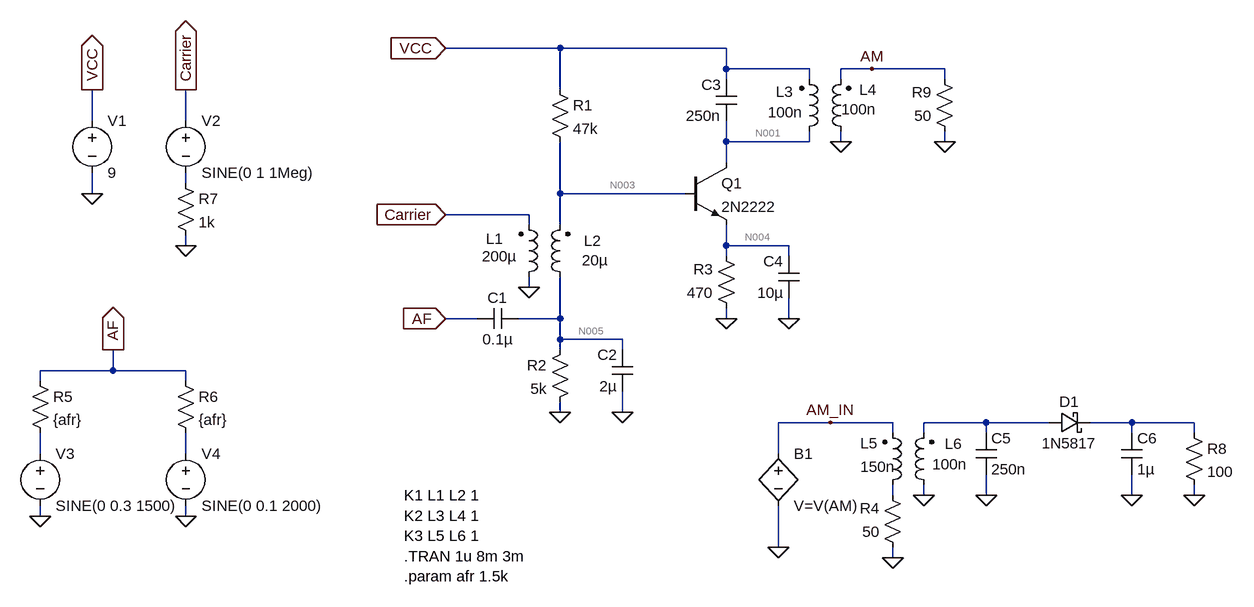
[diagram p0: schematic BaseInjectedAM.asc]
BaseInjectedAM.asc, the LTspice schematic file:
Version 4
SHEET 1 1764 800
WIRE 464 -96 288 -96
WIRE 720 -96 464 -96
WIRE 720 -64 720 -96
WIRE 848 -64 720 -64
WIRE 944 -64 896 -64
WIRE 1056 -64 944 -64
WIRE 720 -48 720 -64
WIRE 848 -48 848 -64
WIRE 896 -48 896 -64
WIRE 1056 -48 1056 -64
WIRE 464 -32 464 -96
WIRE -256 16 -256 -32
WIRE -112 16 -112 -32
WIRE 720 48 720 16
WIRE 848 48 848 32
WIRE 848 48 720 48
WIRE 896 48 896 32
WIRE 1056 48 1056 32
WIRE 720 80 720 48
WIRE -112 112 -112 96
WIRE -256 128 -256 96
WIRE 464 128 464 48
WIRE 656 128 464 128
WIRE 416 160 288 160
WIRE 416 176 416 160
WIRE 464 176 464 128
WIRE -112 208 -112 192
WIRE 720 208 720 176
WIRE 816 208 720 208
WIRE 720 224 720 208
WIRE 816 224 816 208
WIRE 416 272 416 256
WIRE 336 320 288 320
WIRE 464 320 464 256
WIRE 464 320 400 320
WIRE 720 320 720 304
WIRE 816 320 816 288
WIRE 464 352 464 320
WIRE 560 352 464 352
WIRE 464 368 464 352
WIRE 560 368 560 352
WIRE -224 400 -224 368
WIRE -224 400 -336 400
WIRE -112 400 -224 400
WIRE -336 416 -336 400
WIRE -112 416 -112 400
WIRE 464 464 464 448
WIRE 560 464 560 432
WIRE 880 480 800 480
WIRE 976 480 880 480
WIRE 1120 480 1024 480
WIRE 1216 480 1120 480
WIRE 1344 480 1280 480
WIRE 1440 480 1344 480
WIRE 976 496 976 480
WIRE 1024 496 1024 480
WIRE 1120 496 1120 480
WIRE 1344 496 1344 480
WIRE 1440 496 1440 480
WIRE -336 528 -336 496
WIRE -112 528 -112 496
WIRE 800 528 800 480
WIRE 976 592 976 576
WIRE 1024 592 1024 576
WIRE 1120 592 1120 560
WIRE 1344 592 1344 560
WIRE 1440 592 1440 576
WIRE -336 624 -336 608
WIRE -112 624 -112 608
WIRE 800 672 800 608
WIRE 976 688 976 672
FLAG -256 -32 VCC
IOPIN -256 -32 Out
FLAG -256 128 0
FLAG -112 -32 Carrier
IOPIN -112 -32 Out
FLAG 288 -96 VCC
IOPIN 288 -96 In
FLAG 896 48 0
FLAG 976 688 0
FLAG 720 320 0
FLAG 816 320 0
FLAG 464 464 0
FLAG 560 464 0
FLAG 416 272 0
FLAG 288 160 Carrier
IOPIN 288 160 In
FLAG 288 320 AF
IOPIN 288 320 In
FLAG -336 624 0
FLAG -112 624 0
FLAG -224 368 AF
IOPIN -224 368 Out
FLAG -112 208 0
FLAG 1024 592 0
FLAG 1440 592 0
FLAG 1344 592 0
FLAG 1120 592 0
FLAG 1056 48 0
FLAG 800 672 0
FLAG 944 -64 AM
FLAG 880 480 AM_IN
SYMBOL Voltage -256 0 R0
SYMATTR InstName V1
SYMATTR Value 9
SYMBOL npn 656 80 R0
SYMATTR InstName Q1
SYMATTR Value 2N2222
SYMBOL Res 448 -48 R0
SYMATTR InstName R1
SYMATTR Value 47k
SYMBOL Res 480 352 M0
SYMATTR InstName R2
SYMATTR Value 5k
SYMBOL Cap 400 304 R90
WINDOW 0 0 32 VBottom 2
WINDOW 3 32 32 VTop 2
SYMATTR InstName C1
SYMATTR Value 0.1µ
SYMBOL Cap 576 432 R180
WINDOW 0 24 56 Left 2
WINDOW 3 24 8 Left 2
SYMATTR InstName C2
SYMATTR Value 2µ
SYMBOL Cap 736 16 R180
WINDOW 0 24 56 Left 2
WINDOW 3 24 8 Left 2
SYMATTR InstName C3
SYMATTR Value 250n
SYMBOL Cap 832 288 R180
WINDOW 0 24 56 Left 2
WINDOW 3 24 8 Left 2
SYMATTR InstName C4
SYMATTR Value 10µ
SYMBOL Res 736 320 R180
WINDOW 0 36 76 Left 2
WINDOW 3 36 40 Left 2
SYMATTR InstName R3
SYMATTR Value 470
SYMBOL Res 992 688 R180
WINDOW 0 36 76 Left 2
WINDOW 3 36 40 Left 2
SYMATTR InstName R4
SYMATTR Value 50
SYMBOL ind2 400 272 M180
WINDOW 0 -50 75 Left 2
WINDOW 3 -56 48 Left 2
SYMATTR InstName L1
SYMATTR Value 200µ
SYMATTR Type ind
SYMBOL ind2 480 272 R180
WINDOW 0 -48 72 Left 2
WINDOW 3 -58 42 Left 2
SYMATTR InstName L2
SYMATTR Value 20µ
SYMATTR Type ind
SYMBOL ind2 832 48 M180
WINDOW 0 -36 77 Left 2
WINDOW 3 -48 45 Left 2
SYMATTR InstName L3
SYMATTR Value 100n
SYMATTR Type ind
SYMBOL ind2 912 48 R180
WINDOW 0 -40 80 Left 2
WINDOW 3 -39 50 Left 2
SYMATTR InstName L4
SYMATTR Value 100n
SYMATTR Type ind
SYMBOL Voltage -112 0 R0
SYMATTR InstName V2
SYMATTR Value SINE(0 1 1Meg)
SYMBOL Voltage -336 512 R0
SYMATTR InstName V3
SYMATTR Value SINE(0 0.3 1500)
SYMBOL Res -352 400 R0
SYMATTR InstName R5
SYMATTR Value {afr}
SYMBOL Res -128 400 R0
SYMATTR InstName R6
SYMATTR Value {afr}
SYMBOL Voltage -112 512 R0
SYMATTR InstName V4
SYMATTR Value SINE(0 0.1 2000)
SYMBOL Res -128 96 R0
SYMATTR InstName R7
SYMATTR Value 1k
SYMBOL ind2 960 592 M180
WINDOW 0 -34 80 Left 2
WINDOW 3 -34 44 Left 2
SYMATTR InstName L5
SYMATTR Value 150n
SYMATTR Type ind
SYMBOL ind2 1040 592 R180
WINDOW 0 -43 79 Left 2
WINDOW 3 -51 48 Left 2
SYMATTR InstName L6
SYMATTR Value 100n
SYMATTR Type ind
SYMBOL Cap 1104 496 R0
SYMATTR InstName C5
SYMATTR Value 250n
SYMBOL schottky 1216 464 M90
WINDOW 0 0 32 VBottom 2
WINDOW 3 32 32 VTop 2
SYMATTR InstName D1
SYMATTR Value 1N5817
SYMATTR Description Diode
SYMATTR Type diode
SYMBOL Res 1424 480 R0
SYMATTR InstName R8
SYMATTR Value 100
SYMBOL Cap 1328 496 R0
SYMATTR InstName C6
SYMATTR Value 1µ
SYMBOL Res 1072 48 R180
WINDOW 0 36 76 Left 2
WINDOW 3 36 40 Left 2
SYMATTR InstName R9
SYMATTR Value 50
SYMBOL bv 800 512 R0
SYMATTR InstName B1
SYMATTR Value V=V(AM)
TEXT 224 592 Left 2 !K1 L1 L2 1\nK2 L3 L4 1\nK3 L5 L6 1\n.TRAN 1u 8m 3m\n.param afr 1.5k

The netlist it stands for:
* BaseInjectedAM.asc
V1 VCC 0 9
Q1 N001 N003 N004 0 2N2222
R1 VCC N003 47k
R2 N005 0 5k
C1 N005 AF 0.1µ
C2 0 N005 2µ
C3 N001 VCC 250n
C4 0 N004 10µ
R3 0 N004 470
R4 0 N010 50
L1 0 Carrier 200µ
L2 N005 N003 20µ
L3 N001 VCC 100n
L4 0 AM 100n
V2 Carrier N002 SINE(0 1 1Meg)
V3 N008 0 SINE(0 0.3 1500)
R5 AF N008 {afr}
R6 AF N009 {afr}
V4 N009 0 SINE(0 0.1 2000)
R7 N002 0 1k
L5 N010 AM_IN 150n
L6 0 N006 100n
C5 N006 0 250n
D1 N006 N007 1N5817
R8 N007 0 100
C6 N007 0 1µ
R9 0 AM 50
B1 AM_IN 0 V=V(AM)
.model D D
.lib standard.dio
.model NPN NPN
.model PNP PNP
.lib standard.bjt
K1 L1 L2 1
K2 L3 L4 1
K3 L5 L6 1
.TRAN 1u 8m 3m
.param afr 1.5k
.backanno
.end

* Results of the author's LTspice run, read from the files saved beside the schematic
* Operating Point, zero values left out:
*   V(vcc) = 9 V
*   V(n001) = 9 V
*   V(n003) = 855.6 mV
*   V(n004) = 221.8 mV
*   V(n005) = 855.6 mV
*   Ic(Q1) = 469.8 µA
*   Ib(Q1) = 2.175 µA
*   Ie(Q1) = -472 µA
*   I(L2) = -171.1 µA
*   I(L3) = -469.8 µA
*   I(R1) = 173.3 µA
*   I(R2) = 171.1 µA
*   I(R3) = -472 µA
*   I(V1) = -643.1 µA